# EAGLE design USBdimmer-breakout (EAGLE 6.6.0)
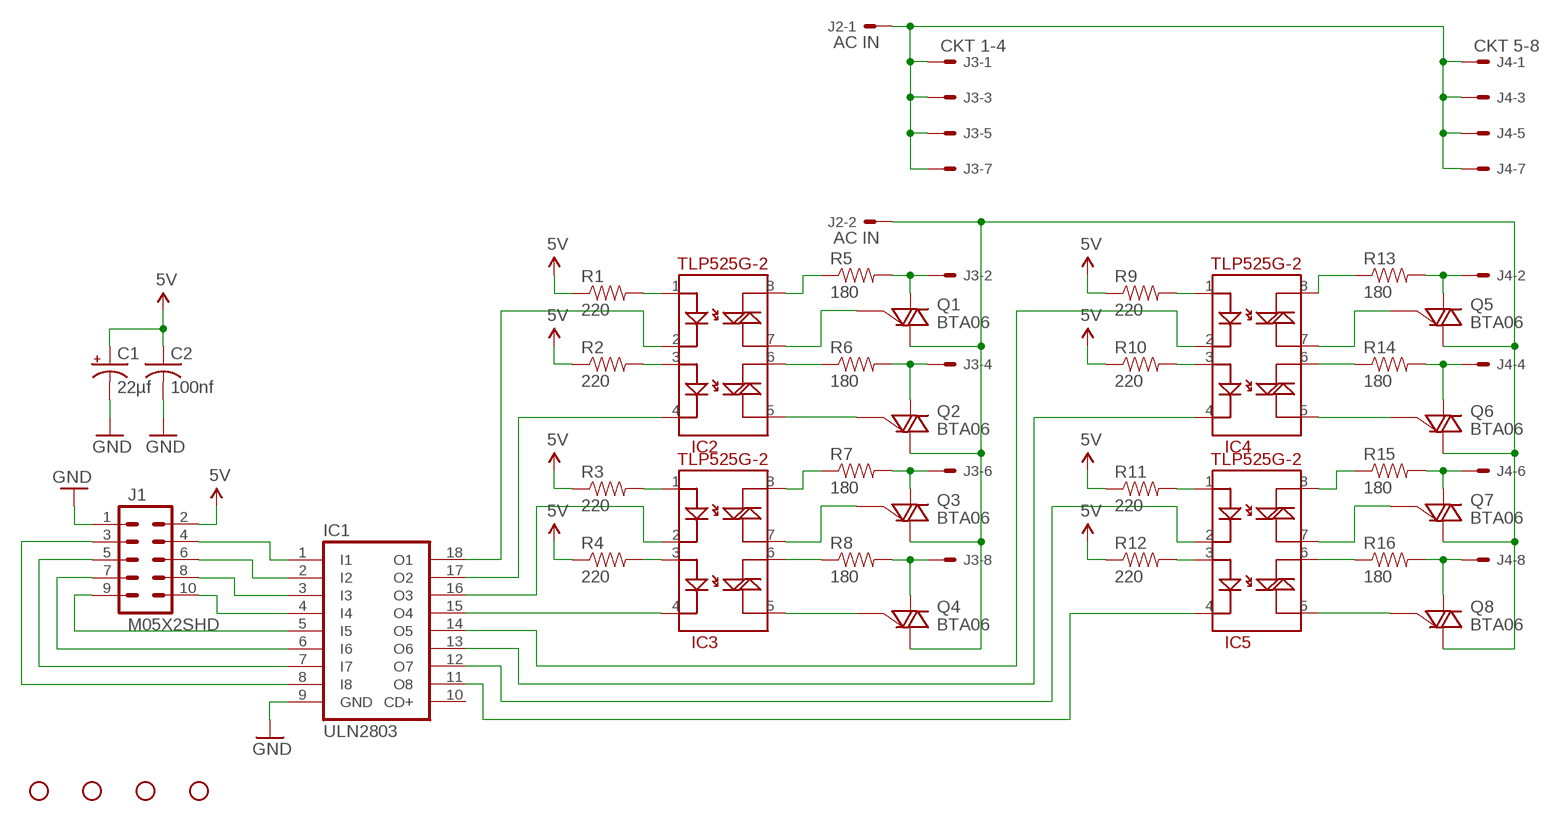
[diagram p0: schematic, sheet 1]

## Parts
C1  22µf  CPOL-USE5-8.5  [E5-8,5]
C2  100nf  C-US025-030X050  [C025-030X050]
IC1  ULN2803  ULN2803A  [DIL18]
IC2  TLP525G-2  [DIL08]
IC3  TLP525G-2  [DIL08]
IC4  TLP525G-2  [DIL08]
IC5  TLP525G-2  [DIL08]
J1  M05X2SHD  [2X5-SHROUDED]
J2  AC IN  KK-156-2  [KK-156-2]
J3  CKT 1-4  KK-156-8  [KK-156-8]
J4  CKT 5-8  KK-156-8  [KK-156-8]
Q1  BTA06  [TO220BV]
Q2  BTA06  [TO220BV]
Q3  BTA06  [TO220BV]
Q4  BTA06  [TO220BV]
Q5  BTA06  [TO220BV]
Q6  BTA06  [TO220BV]
Q7  BTA06  [TO220BV]
Q8  BTA06  [TO220BV]
R1  220  RESISTORPTH-1/4W  [AXIAL-0.4]
R2  220  RESISTORPTH-1/4W  [AXIAL-0.4]
R3  220  RESISTORPTH-1/4W  [AXIAL-0.4]
R4  220  RESISTORPTH-1/4W  [AXIAL-0.4]
R5  180  RESISTORPTH-1/4W  [AXIAL-0.4]
R6  180  RESISTORPTH-1/4W  [AXIAL-0.4]
R7  180  RESISTORPTH-1/4W  [AXIAL-0.4]
R8  180  RESISTORPTH-1/4W  [AXIAL-0.4]
R9  220  RESISTORPTH-1/4W  [AXIAL-0.4]
R10  220  RESISTORPTH-1/4W  [AXIAL-0.4]
R11  220  RESISTORPTH-1/4W  [AXIAL-0.4]
R12  220  RESISTORPTH-1/4W  [AXIAL-0.4]
R13  180  RESISTORPTH-1/4W  [AXIAL-0.4]
R14  180  RESISTORPTH-1/4W  [AXIAL-0.4]
R15  180  RESISTORPTH-1/4W  [AXIAL-0.4]
R16  180  RESISTORPTH-1/4W  [AXIAL-0.4]
STANDOFF1  STAND-OFF  [STAND-OFF]
STANDOFF2  STAND-OFF  [STAND-OFF]
STANDOFF3  STAND-OFF  [STAND-OFF]
STANDOFF4  STAND-OFF  [STAND-OFF]

## Nets
5V: C1.+ C2.1 J1.2 R1.P$1 R2.P$1 R3.P$1 R4.P$1 R9.P$1 R10.P$1 R11.P$1 R12.P$1
GND: C1.- C2.2 IC1.9(GND) J1.1
N$1: J2.2 Q1.2(MT2) Q2.2(MT2) Q3.2(MT2) Q4.2(MT2) Q5.2(MT2) Q6.2(MT2) Q7.2(MT2) Q8.2(MT2)
N$2: IC3.3(A2) R4.P$2
N$3: IC3.1(A1) R3.P$2
N$4: IC3.6(MT21) R8.P$1
N$5: IC3.5(MT22) Q4.3(G)
N$6: J3.8 Q4.1(MT1) R8.P$2
N$7: J3.6 Q3.1(MT1) R7.P$2
N$8: IC3.7(MT12) Q3.3(G)
N$9: IC3.8(MT11) R7.P$1
N$10: J3.4 Q2.1(MT1) R6.P$2
N$11: IC1.11(O8) IC5.4(K2)
N$12: IC5.3(A2) R12.P$2
N$13: IC5.1(A1) R11.P$2
N$14: IC2.5(MT22) Q2.3(G)
N$15: J3.2 Q1.1(MT1) R5.P$2
N$16: IC5.6(MT21) R16.P$1
N$17: J4.2 Q5.1(MT1) R13.P$2
N$18: J2.1 J3.1 J3.3 J3.5 J3.7 J4.1 J4.3 J4.5 J4.7
N$19: J4.4 Q6.1(MT1) R14.P$2
N$20: IC2.3(A2) R2.P$2
N$21: IC5.7(MT12) Q7.3(G)
N$22: IC5.8(MT11) R15.P$1
N$23: J4.6 Q7.1(MT1) R15.P$2
N$24: IC2.1(A1) R1.P$2
N$25: IC2.6(MT21) R6.P$1
N$26: IC4.5(MT22) Q6.3(G)
N$27: IC4.6(MT21) R14.P$1
N$28: IC4.7(MT12) Q5.3(G)
N$29: IC2.7(MT12) Q1.3(G)
N$30: IC4.8(MT11) R13.P$1
N$31: IC4.1(A1) R9.P$2
N$32: IC5.5(MT22) Q8.3(G)
N$33: IC4.3(A2) R10.P$2
N$35: IC2.8(MT11) R5.P$1
N$36: IC1.12(O7) IC5.2(K1)
N$37: IC1.13(O6) IC4.4(K2)
N$38: IC1.14(O5) IC4.2(K1)
N$39: IC1.15(O4) IC3.4(K2)
N$40: IC1.16(O3) IC3.2(K1)
N$41: IC1.17(O2) IC2.4(K2)
N$42: IC1.18(O1) IC2.2(K1)
N$43: IC1.1(I1) J1.4
N$44: IC1.2(I2) J1.6
N$45: IC1.3(I3) J1.8
N$46: IC1.4(I4) J1.10
N$47: IC1.5(I5) J1.9
N$48: IC1.6(I6) J1.7
N$49: IC1.7(I7) J1.5
N$50: IC1.8(I8) J1.3
N$52: J4.8 Q8.1(MT1) R16.P$2
Unconnected: IC1.10(CD+)

## Library data of the parts
C1 = adafruit:CPOL-US: POLARIZED CAPACITOR, American symbol
C2 = adafruit:C-US: CAPACITOR, American symbol
IC1 = uln-udn:ULN2803A: DRIVER ARRAY
IC2-IC5 = bodger:TLP525G-2: Dual triac optocoupler
J1 = bodger:M05X2: Header 5x2 Standard 10-pin dual row 0.1" header. Commonly used with AVR-ISP. Use with Spark Fun Electronics SKU: PRT-00778
J2 = con-molex:KK-156-2: KK 156 HEADER Source: http://www.molex.com/pdm_docs/sd/026604100_sd.pdf; OC_FARNELL: unknown; OC_NEWARK: unknown
J3 J4 = con-molex:KK-156-8: KK 156 HEADER Source: http://www.molex.com/pdm_docs/sd/026604100_sd.pdf; OC_FARNELL: unknown; OC_NEWARK: unknown
Q1-Q8 = bodger:BTA06
R1-R16 = SparkFun-Passives:RESISTOR: Resistor Basic schematic elements and footprints for 0603, 1206, and PTH resistors.
STANDOFF1-STANDOFF4 = SparkFun-Electromechanical:STAND-OFF: #4 Stand Off This is the mechanical footprint for a #4 phillips button head screw. Use the keepout ring to avoid running the screw head into surrounding components. SKU : PRT-00447

## Board
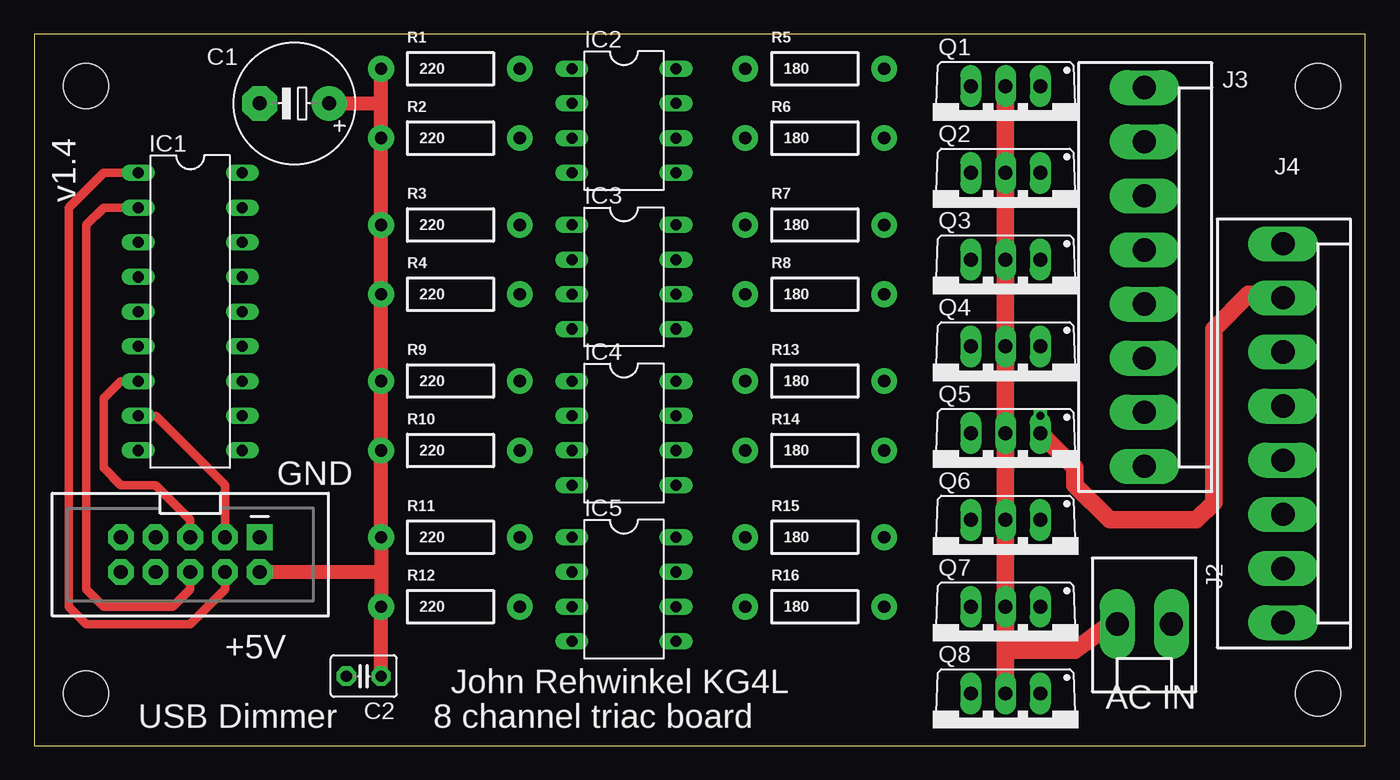
[diagram p1: board, top side]
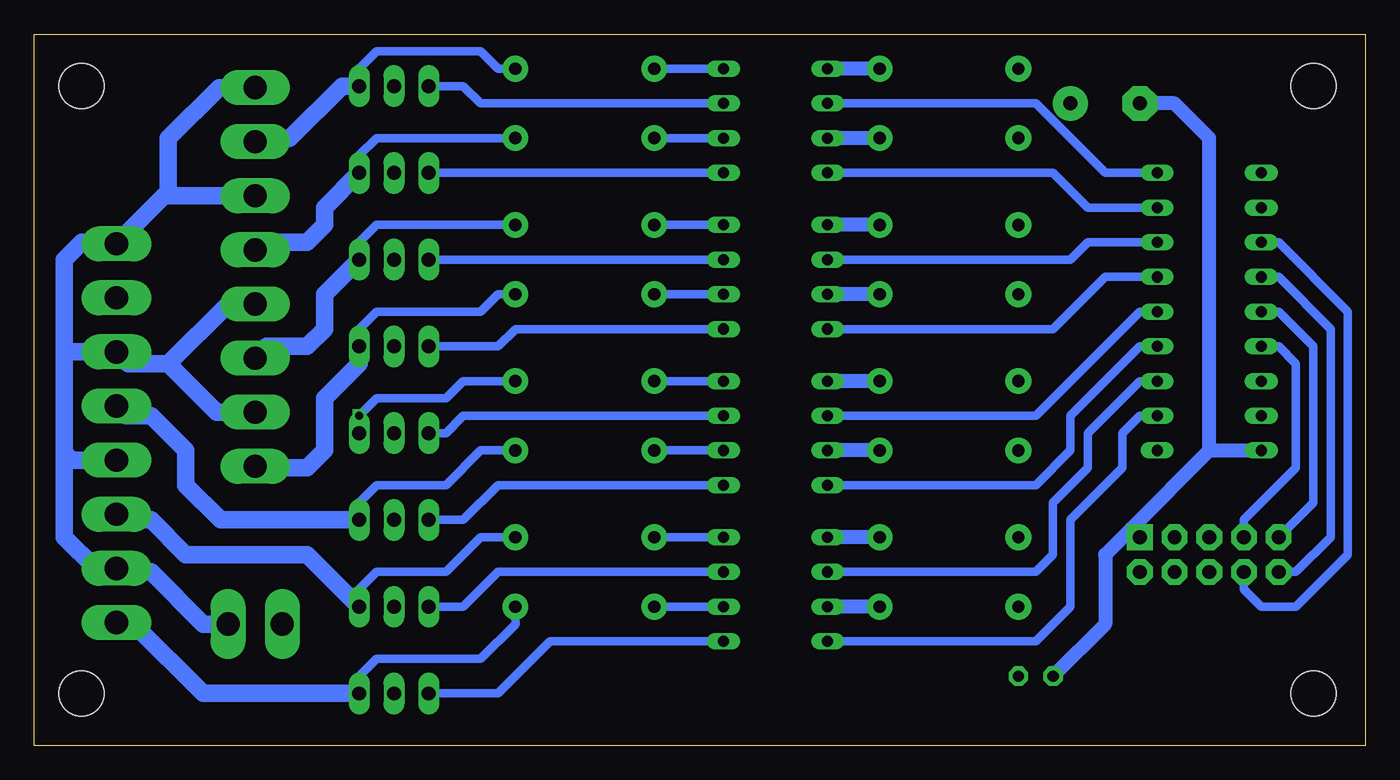
[diagram p2: board, bottom side, seen from below]

Size 97.46 x 52.06 mm. Coordinates in mm from the lower left corner, seen from the top.
Outline: 0,0 97.46,0 97.46,52.06 0,52.06 0,0
Copper layers (1*16): Top 0.0356mm / dielectric 1.5011mm / Bottom 0.0356mm
Design rules "LaenPCBOrder": minimum track width 6mil, minimum drill 13mil, track to track 6mil, track to pad 6mil, pad to pad 6mil, via to via 6mil, smd to smd 6mil, copper to edge 15mil, drill to drill 6mil, minimum pad ring 7mil, minimum via ring 7mil, stop-mask expansion 3mil, vias tented up to drill 0mil, thermal gap 10mil

### Footprints (pad centres in the part's own frame; a part is rotated, then mirrored left to right if it is on the bottom)
E5-8,5 = drill 1.016 pad 2.54: + -2.54,0 | drill 1.016 pad 2.54 octagon: - 2.54,0
C025-030X050 = drill 0.813 pad 1.422 octagon: 1 -1.27,0; 2 1.27,0
DIL18 = drill 0.813 long: 1 -10.16,-3.81; 2 -7.62,-3.81; 3 -5.08,-3.81; 4 -2.54,-3.81; 5 0,-3.81; 6 2.54,-3.81; 7 5.08,-3.81; 8 7.62,-3.81; 9 10.16,-3.81; 10 10.16,3.81; 11 7.62,3.81; 12 5.08,3.81; 13 2.54,3.81; 14 0,3.81; 15 -2.54,3.81; 16 -5.08,3.81; 17 -7.62,3.81; 18 -10.16,3.81
DIL08 = drill 0.813 long: 1 -3.81,-3.81; 2 -1.27,-3.81; 3 1.27,-3.81; 4 3.81,-3.81; 5 3.81,3.81; 6 1.27,3.81; 7 -1.27,3.81; 8 -3.81,3.81
2X5-SHROUDED = drill 1.016 pad 1.88 square: 1 -1.27,5.08 | drill 1.016 pad 1.88 octagon: 2 1.27,5.08; 3 -1.27,2.54; 4 1.27,2.54; 5 -1.27,0; 6 1.27,0; 7 -1.27,-2.54; 8 1.27,-2.54; 9 -1.27,-5.08; 10 1.27,-5.08
KK-156-2 = drill 1.7 pad 2.184 long: 1 -1.98,0; 2 1.98,0
KK-156-8 = drill 1.7 pad 2.184 long: 1 -13.86,0; 2 -9.9,0; 3 -5.94,0; 4 -1.98,0; 5 1.98,0; 6 5.94,0; 7 9.9,0; 8 13.86,0
TO220BV = drill 1.016 long: 1 -2.54,-2.54; 2 0,-2.54; 3 2.54,-2.54
AXIAL-0.4 = drill 0.9 pad 1.88: P$1 -5.08,0; P$2 5.08,0
STAND-OFF = hole 3.302: 0,0

### Placement (x,y rotation side)
C1  19.05,46.99 180 top
C2  24.13,5.08 180 top
IC1  11.43,31.75 270 top
IC2  43.18,45.72 270 top
IC3  43.18,34.29 270 top
IC4  43.18,22.86 270 top
IC5  43.18,11.43 270 top
J1  11.43,13.97 270 top
J2  81.28,8.89 180 top
J3  81.28,34.29 270 top
J4  91.44,22.86 270 top
Q1  71.12,45.72 180 top
Q2  71.12,39.37 180 top
Q3  71.12,33.02 180 top
Q4  71.12,26.67 180 top
Q5  71.12,20.32 180 top
Q6  71.12,13.97 180 top
Q7  71.12,7.62 180 top
Q8  71.12,1.27 180 top
R1  30.48,49.53 0 top
R2  30.48,44.45 0 top
R3  30.48,38.1 0 top
R4  30.48,33.02 0 top
R5  57.15,49.53 0 top
R6  57.15,44.45 0 top
R7  57.15,38.1 0 top
R8  57.15,33.02 0 top
R9  30.48,26.67 0 top
R10  30.48,21.59 0 top
R11  30.48,15.24 0 top
R12  30.48,10.16 0 top
R13  57.15,26.67 0 top
R14  57.15,21.59 0 top
R15  57.15,15.24 0 top
R16  57.15,10.16 0 top
STANDOFF1  3.81,3.81 0 top
STANDOFF2  3.81,48.26 0 top
STANDOFF3  93.98,48.26 0 top
STANDOFF4  93.98,3.81 0 top

### Tracks (layer width: path | path; a pad name or v marks a point on that pad's centre or on a via)
5V
  Top 1.016: 25.4,12.7 R11.P$1 R10.P$1 R9.P$1 R4.P$1 R3.P$1 R2.P$1 25.4,46.99 | 25.4,12.7 R12.P$1 C2.1 | J1.2 25.4,12.7 | 25.4,46.99 R1.P$1 | C1.+ 25.4,46.99
GND
  Bottom 1.016: 17.14,15.88 19.05,13.97 19.05,8.89 C2.2 | 17.14,15.88 11.43,21.59 | 11.43,21.59 IC1.9 | 11.43,21.59 11.43,44.45 13.97,46.99 C1.- | J1.1 17.14,15.88
N$1
  Top 1.27: Q1.2 Q2.2 Q3.2 Q4.2 Q5.2 Q6.2 Q7.2 71.12,6.99 | 71.12,6.99 Q8.2 | J2.2 78.74,8.89 76.2,6.99 71.12,6.99
N$2
  Bottom 1.016: R4.P$2 IC3.3
N$3
  Bottom 1.016: R3.P$2 IC3.1
N$4
  Bottom 0.61: R8.P$1 IC3.6
N$5
  Bottom 0.61: IC3.5 62.23,30.48 63.5,29.21 Q4.3
N$6
  Bottom 0.61: R8.P$2 63.5,33.02 64.77,31.75 72.39,31.75 73.66,30.48 Q4.1
  Bottom 1.016: 81.17,20.32 J3.8
  Bottom 1.27: Q4.1 73.66,27.94 76.2,25.4 76.2,21.59 77.47,20.32 81.17,20.32
N$7
  Bottom 0.61: R7.P$2 72.39,38.1 73.66,36.83 Q3.1
  Bottom 1.27: Q3.1 76.2,33.02 76.2,30.48 77.47,29.21 80.42,29.21 J3.6
N$8
  Bottom 0.61: IC3.7 Q3.3
N$9
  Bottom 0.61: R7.P$1 IC3.8
N$10
  Bottom 0.61: R6.P$2 72.39,44.45 73.66,43.18 Q2.1
  Bottom 1.27: Q2.1 76.2,39.37 76.2,38.1 77.47,36.83 80.72,36.83 J3.4
N$11
  Bottom 0.61: IC1.11 16.51,24.13 17.78,22.86 17.78,20.32 21.59,16.51 21.59,10.16 24.13,7.62 IC5.4
N$12
  Bottom 1.016: R12.P$2 IC5.3
N$13
  Bottom 1.016: R11.P$2 IC5.1
N$14
  Bottom 0.61: IC2.5 Q2.3
N$15
  Bottom 0.61: Q1.1 73.66,49.53 72.39,50.8 64.77,50.8 63.5,49.53 R5.P$2
  Bottom 1.27: Q1.1 74.93,48.26 78.74,44.45 81.02,44.45 J3.2
N$16
  Bottom 0.61: R16.P$1 IC5.6
N$17  (via drill 0.6)
  Top 1.016: v73.66,24.13 Q5.1
  Top 1.27: Q5.1 76.2,20.32 76.2,19.05 78.74,16.51 85.09,16.51 86.36,17.78 86.36,30.48 88.9,33.02 91.18,33.02 J4.2
  Bottom 0.61: R13.P$2 66.04,26.67 67.31,25.4 72.39,25.4 v73.66,24.13 Q5.1
N$18
  Bottom 1.016: 91.55,36.83 J4.1 | 94.84,28.8 95.25,29.21 | 94.54,20.88 95.25,21.59 | 87.63,40.23 87.93,40.23
  Bottom 1.27: 91.55,36.83 93.98,36.83 95.25,35.56 95.25,29.21 95.25,21.59 95.25,15.24 92.97,12.96 J4.7 91.18,12.7 88.9,12.7 85.09,8.89 J2.1 | 94.84,28.8 J4.3 90.58,27.94 87.63,27.94 | J4.5 94.54,20.88 | J3.7 84.08,24.39 87.63,27.94 | J3.5 83.26,32.31 87.63,27.94 | J3.3 87.63,40.23 87.63,44.45 83.93,48.15 J3.1 | 87.93,40.23 J4.1
N$19
  Bottom 0.61: R14.P$2 64.77,21.59 67.31,19.05 72.39,19.05 73.66,17.78 Q6.1
  Bottom 1.27: Q6.1 83.82,16.51 86.36,19.05 86.36,21.59 88.9,24.13 90.73,24.13 J4.4
N$20
  Bottom 1.016: R2.P$2 IC2.3
N$21
  Bottom 0.61: IC5.7 63.5,12.7 66.04,10.16 Q7.3
N$22
  Bottom 0.61: R15.P$1 IC5.8
N$23
  Bottom 0.61: R15.P$2 64.77,15.24 67.31,12.7 72.39,12.7 73.66,11.43 Q7.1
  Bottom 1.27: Q7.1 77.47,13.97 86.36,13.97 88.9,16.51 91.03,16.51 J4.6
N$24
  Bottom 1.016: R1.P$2 IC2.1
N$25
  Bottom 0.61: R6.P$1 IC2.6
N$26
  Bottom 0.61: IC4.5 63.5,19.05 66.04,16.51 Q6.3
N$27
  Bottom 0.61: R14.P$1 IC4.6
N$28
  Bottom 0.61: IC4.7 66.04,24.13 67.31,22.86 Q5.3
N$29
  Bottom 0.61: IC2.7 64.77,46.99 66.04,48.26 Q1.3
N$30
  Bottom 0.61: R13.P$1 IC4.8
N$31
  Bottom 1.016: R9.P$2 IC4.1
N$32
  Bottom 0.61: IC5.5 59.69,7.62 63.5,3.81 Q8.3
N$33
  Bottom 1.016: R10.P$2 IC4.3
N$35
  Bottom 0.61: R5.P$1 IC2.8
N$36
  Bottom 0.61: IC1.12 16.51,26.67 20.32,22.86 20.32,20.32 22.86,17.78 22.86,13.97 24.13,12.7 IC5.2
N$37
  Bottom 0.61: IC1.13 16.51,29.21 21.59,24.13 21.59,21.59 24.13,19.05 IC4.4
N$38
  Bottom 0.61: IC1.14 16.51,31.75 24.13,24.13 IC4.2
N$39
  Bottom 0.61: IC1.15 19.05,34.29 22.86,30.48 IC3.4
N$40
  Bottom 0.61: IC1.16 20.32,36.83 21.59,35.56 IC3.2
N$41
  Bottom 0.61: IC1.17 20.32,39.37 22.86,41.91 IC2.4
N$42
  Bottom 0.61: IC1.18 19.05,41.91 24.13,46.99 IC2.2
N$43
  Top 0.61: J1.4 13.97,11.43 11.43,8.89 3.81,8.89 2.54,10.16 2.54,39.37 5.08,41.91 IC1.1
N$44
  Top 0.61: J1.6 11.43,11.43 10.16,10.16 5.08,10.16 3.81,11.43 3.81,38.1 5.08,39.37 IC1.2
N$45
  Bottom 0.61: IC1.3 6.35,36.83 1.27,31.75 1.27,13.97 5.08,10.16 7.62,10.16 8.89,11.43 J1.8
N$46
  Bottom 0.61: IC1.4 6.35,34.29 2.54,30.48 2.54,15.24 5.08,12.7 J1.10
N$47
  Bottom 0.61: IC1.5 6.35,31.75 3.81,29.21 3.81,17.78 J1.9
N$48
  Bottom 0.61: IC1.6 6.35,29.21 5.08,27.94 5.08,20.32 8.89,16.51 J1.7
N$49
  Top 0.61: IC1.7 6.35,26.67 5.08,25.4 5.08,20.32 6.35,19.05 8.89,19.05 11.43,16.51 J1.5
N$50
  Top 0.61: IC1.8 8.89,24.13 13.97,19.05 J1.3
N$52
  Bottom 0.61: R16.P$2 62.23,8.89 64.77,6.35 72.39,6.35 73.66,5.08 Q8.1
  Bottom 1.016: 91.33,8.89 J4.8
  Bottom 1.27: Q8.1 85.09,3.81 90.17,8.89 91.33,8.89

### Text on the board
tPlace: v1.4 | GND | +5V | John Rehwinkel KG4L | AC IN | USB Dimmer | 8 channel triac board